# EAGLE design UI Adapter (EAGLE 9.6.0)

## Sheet 1 of 2
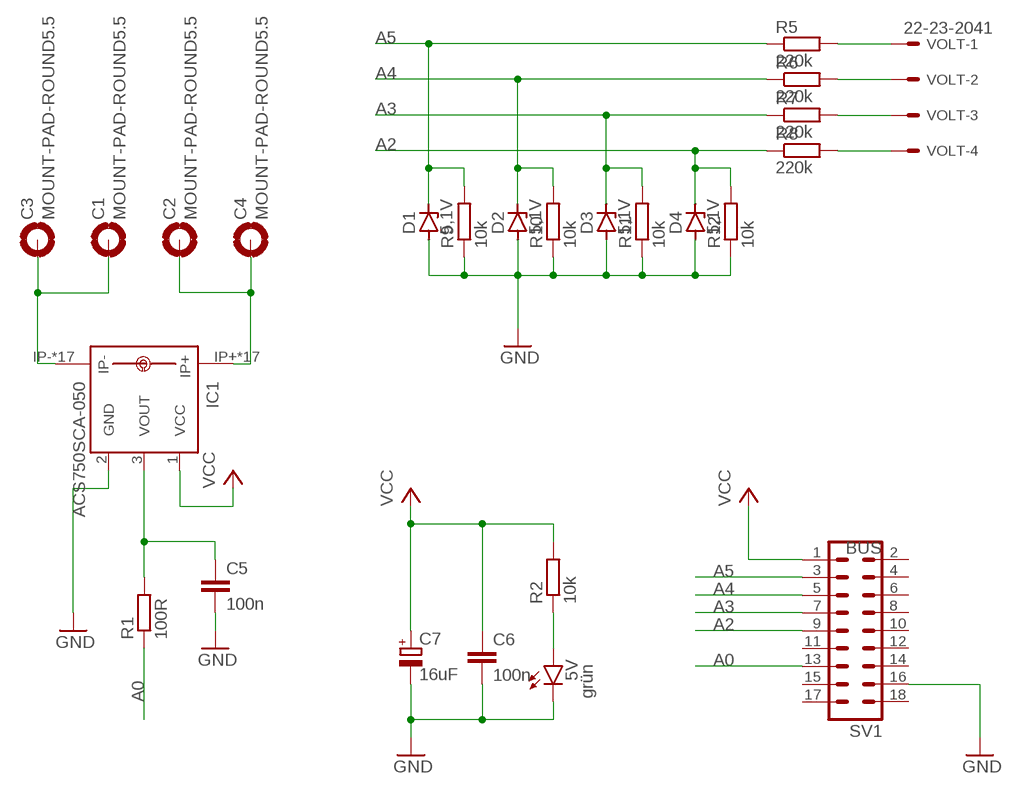
[diagram p0: schematic, sheet 1]

### Parts
5V  grün  LED3MM  [LED3MM]
C1  MOUNT-PAD-ROUND5.5  [5,5-PAD]
C2  MOUNT-PAD-ROUND5.5  [5,5-PAD]
C3  MOUNT-PAD-ROUND5.5  [5,5-PAD]
C4  MOUNT-PAD-ROUND5.5  [5,5-PAD]
C5  100n  C-EU025-024X044  [C025-024X044]
C6  100n  C-EU025-024X044  [C025-024X044]
C7  16uF  CPOL-EUE2-5  [E2-5]
D1  5,1V  ZENER-DIODEZD-7.5  [ZDIO-7.5]
D2  5,1V  ZENER-DIODEZD-7.5  [ZDIO-7.5]
D3  5,1V  ZENER-DIODEZD-7.5  [ZDIO-7.5]
D4  5,1V  ZENER-DIODEZD-7.5  [ZDIO-7.5]
IC1  ACS750SCA-050  [ACS75050]
R1  100R  R-EU_0204/2V  [0204V]
R2  10k  R-EU_0204/2V  [0204V]
R5  220k  R-EU_0204/2V  [0204V]
R6  220k  R-EU_0204/2V  [0204V]
R7  220k  R-EU_0204/2V  [0204V]
R8  220k  R-EU_0204/2V  [0204V]
R9  10k  R-EU_0204/2V  [0204V]
R10  10k  R-EU_0204/2V  [0204V]
R11  10k  R-EU_0204/2V  [0204V]
R12  10k  R-EU_0204/2V  [0204V]
SV1  BUS  MA09-2  [MA09-2]
VOLT  22-23-2041  [22-23-2041]

### Nets
A0: R1.1 SV1.13
A2: D4.C R8.1 R12.2 SV1.9
A3: D3.C R7.1 R11.2 SV1.7
A4: D2.C R6.1 R10.2 SV1.5
A5: D1.C R5.1 R9.2 SV1.3
C1: C1.B5,5(MOUNT) C3.B5,5(MOUNT) IC1.IP- IC1.IP-@2(IP-) IC1.IP-@3(IP-) IC1.IP-@4(IP-) IC1.IP-@5(IP-) IC1.IP-@6(IP-) IC1.IP-@7(IP-) IC1.IP-@8(IP-) IC1.IP-@9(IP-) IC1.IP-@10(IP-) IC1.IP-@11(IP-) IC1.IP-@12(IP-) IC1.IP-@13(IP-) IC1.IP-@14(IP-) IC1.IP-@15(IP-) IC1.IP-@16(IP-) IC1.IP-@17(IP-)
C2: C2.B5,5(MOUNT) C4.B5,5(MOUNT) IC1.IP+ IC1.IP+@2(IP+) IC1.IP+@3(IP+) IC1.IP+@4(IP+) IC1.IP+@5(IP+) IC1.IP+@6(IP+) IC1.IP+@7(IP+) IC1.IP+@8(IP+) IC1.IP+@9(IP+) IC1.IP+@10(IP+) IC1.IP+@11(IP+) IC1.IP+@12(IP+) IC1.IP+@13(IP+) IC1.IP+@14(IP+) IC1.IP+@15(IP+) IC1.IP+@16(IP+) IC1.IP+@17(IP+)
GND: 5V.K(C) C5.2 C6.2 C7.- D1.A D2.A D3.A D4.A IC1.2(GND) R9.1 R10.1 R11.1 R12.1 SV1.16
N$1: 5V.A R2.1
N$3: C5.1 IC1.3(VOUT) R1.2
N$8: R5.2 VOLT.1
N$9: R6.2 VOLT.2
N$10: R7.2 VOLT.3
N$11: R8.2 VOLT.4
VCC: C6.1 C7.+ IC1.1(VCC) R2.2 SV1.1
Unconnected: SV1.2 SV1.4 SV1.6 SV1.8 SV1.10 SV1.11 SV1.12 SV1.14 SV1.15 SV1.17 SV1.18

## Sheet 2 of 2

## Library data of the parts
5V = led:LED: LED OSRAM: - CHIPLED LG R971, LG N971, LY N971, LG Q971, LY Q971, LO R971, LY R971 LH N974, LH R974 LS Q976, LO Q976, LY Q976 LO Q996 - Hyper CHIPLED LW Q18S LB Q993, LB Q99A, LB R99A - SideLED LS A670, LO A670, LY A670, LG A670, LP A670 LB A673, LV A673, LT A673, LW A673 LH A674 LY A675 LS A676, LA A676, LO A676, LY A676, LW A676 LS A679, LY A679, LG A679 - Hyper Micro SIDELED® LS Y876, LA Y876, LO Y876, LY Y876 LT Y87S - SmartLED LW L88C, LW L88S LB L89C, LB L89S, LG L890 LS L89K, LO L89K, LY L89K LS L896, LA L896, LO L896, LY L896 - TOPLED LS T670, LO T670, LY T670, LG T670, LP T670 LSG T670, LSP T670, LSY T670, LOP T670, LYG T670 LG T671, LOG T671, LSG T671 LB T673, LV T673, LT T673, LW T673 LH T674 LS T676, LA T676, LO T676, LY T676, LB T676, LH T676, LSB T676, LW T676 LB T67C, LV T67C, LT T67C, LS T67K, LO T67K, LY T67K, LW E67C LS E67B, LA E67B, LO E67B, LY E67B, LB E67C, LV E67C, LT E67C LW T67C LS T679, LY T679, LG T679 LS T770, LO T770, LY T770, LG T770, LP T770 LB T773, LV T773, LT T773, LW T773 LH T774 LS E675, LA E675, LY E675, LS T675 LS T776, LA T776, LO T776, LY T776, LB T776 LHGB T686 LT T68C, LB T68C - Hyper Mini TOPLED® LB M676 - Mini TOPLED Santana® LG M470 LS M47K, LO M47K, LY M47K Source: http://www.osram.convergy.de LUXEON: - LUMILED® LXK2-PW12-R00, LXK2-PW12-S00, LXK2-PW14-U00, LXK2-PW14-V00 LXK2-PM12-R00, LXK2-PM12-S00, LXK2-PM14-U00 LXK2-PE12-Q00, LXK2-PE12-R00, LXK2-PE12-S00, LXK2-PE14-T00, LXK2-PE14-U00 LXK2-PB12-K00, LXK2-PB12-L00, LXK2-PB12-M00, LXK2-PB14-N00, LXK2-PB14-P00, LXK2-PB14-Q00 LXK2-PR12-L00, LXK2-PR12-M00, LXK2-PR14-Q00, LXK2-PR14-R00 LXK2-PD12-Q00, LXK2-PD12-R00, LXK2-PD12-S00 LXK2-PH12-R00, LXK2-PH12-S00 LXK2-PL12-P00, LXK2-PL12-Q00, LXK2-PL12-R00 Source: www.luxeon.com KINGBRIGHT: KA-3528ASYC Source: www.kingbright.com
C1-C4 = holes:MOUNT-PAD-ROUND: MOUNTING PAD, round
C5 C6 = rcl:C-EU: CAPACITOR, European symbol; SPICEPREFIX: C
C7 = rcl:CPOL-EU: POLARIZED CAPACITOR, European symbol; SPICEPREFIX: C
D1-D4 = diode:ZENER-DIODE: Z-Diode
IC1 = allegro:ACS750*CA-050: Current Sensor display layer 49 Reference in BRD and place VIAs on circles Source: www.allegromicro.com/datafile/0750-050.pdf; MF: ALLEGRO MICROSYSTEMS, INC.; MPN: ACS750SCA-050; OC_FARNELL: 1457175; OC_NEWARK: 81H6588
R1 R2 R5-R12 = rcl:R-EU_: RESISTOR, European symbol; SPICEPREFIX: R
SV1 = con-lstb:MA09-2: PIN HEADER; OC_FARNELL: unknown; OC_NEWARK: unknown
VOLT = con-molex:22-23-2041: .100" (2.54mm) Center Header - 4 Pin; MF: MOLEX; MPN: 22-23-2041; OC_FARNELL: 1462920; OC_NEWARK: 38C0355

## Board
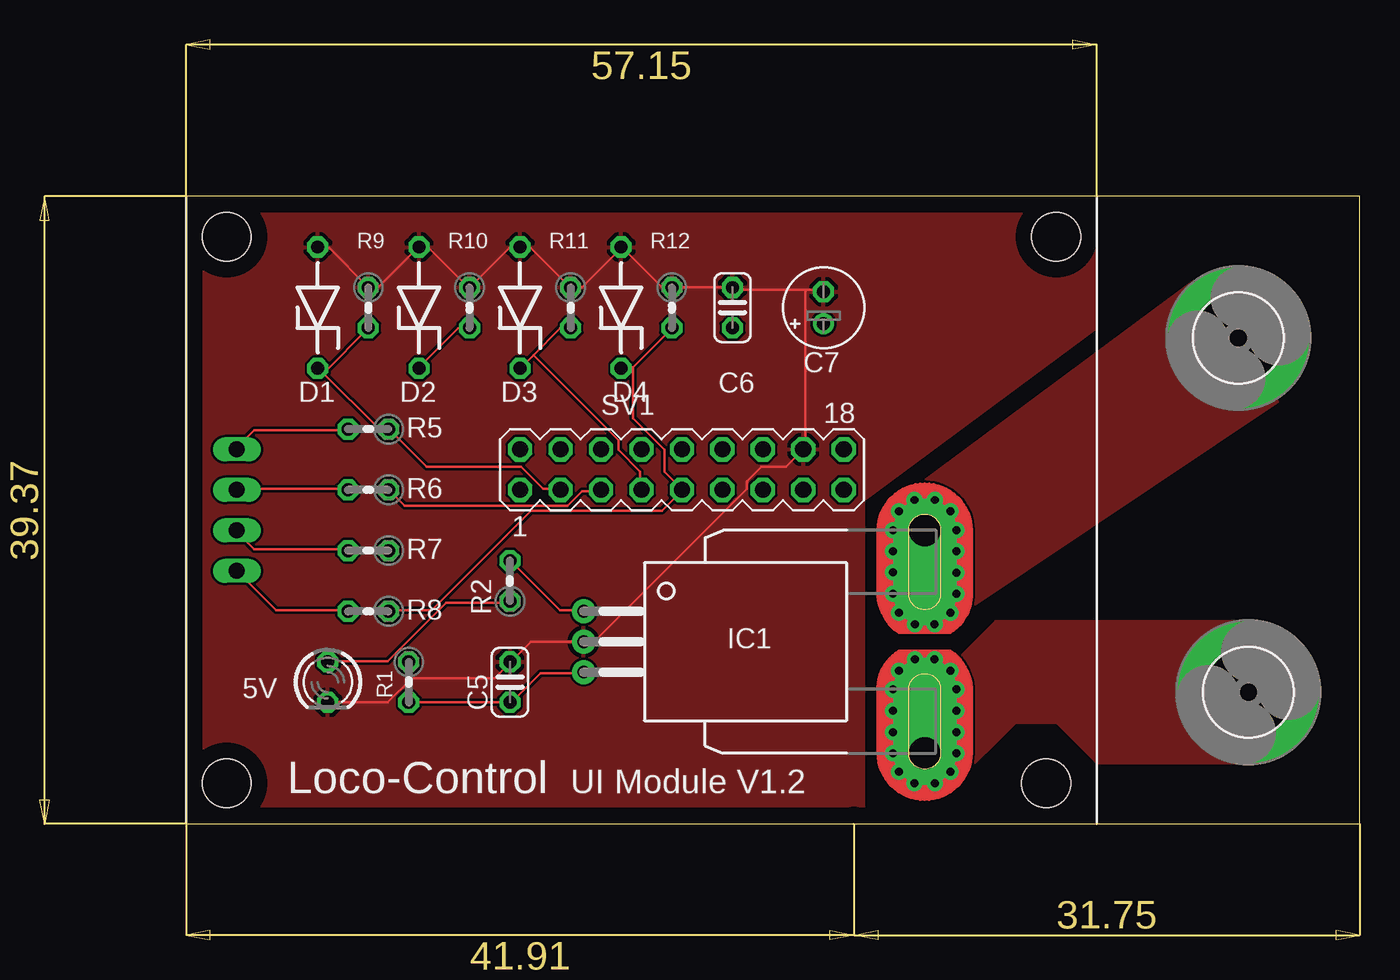
[diagram p1: board, top side]
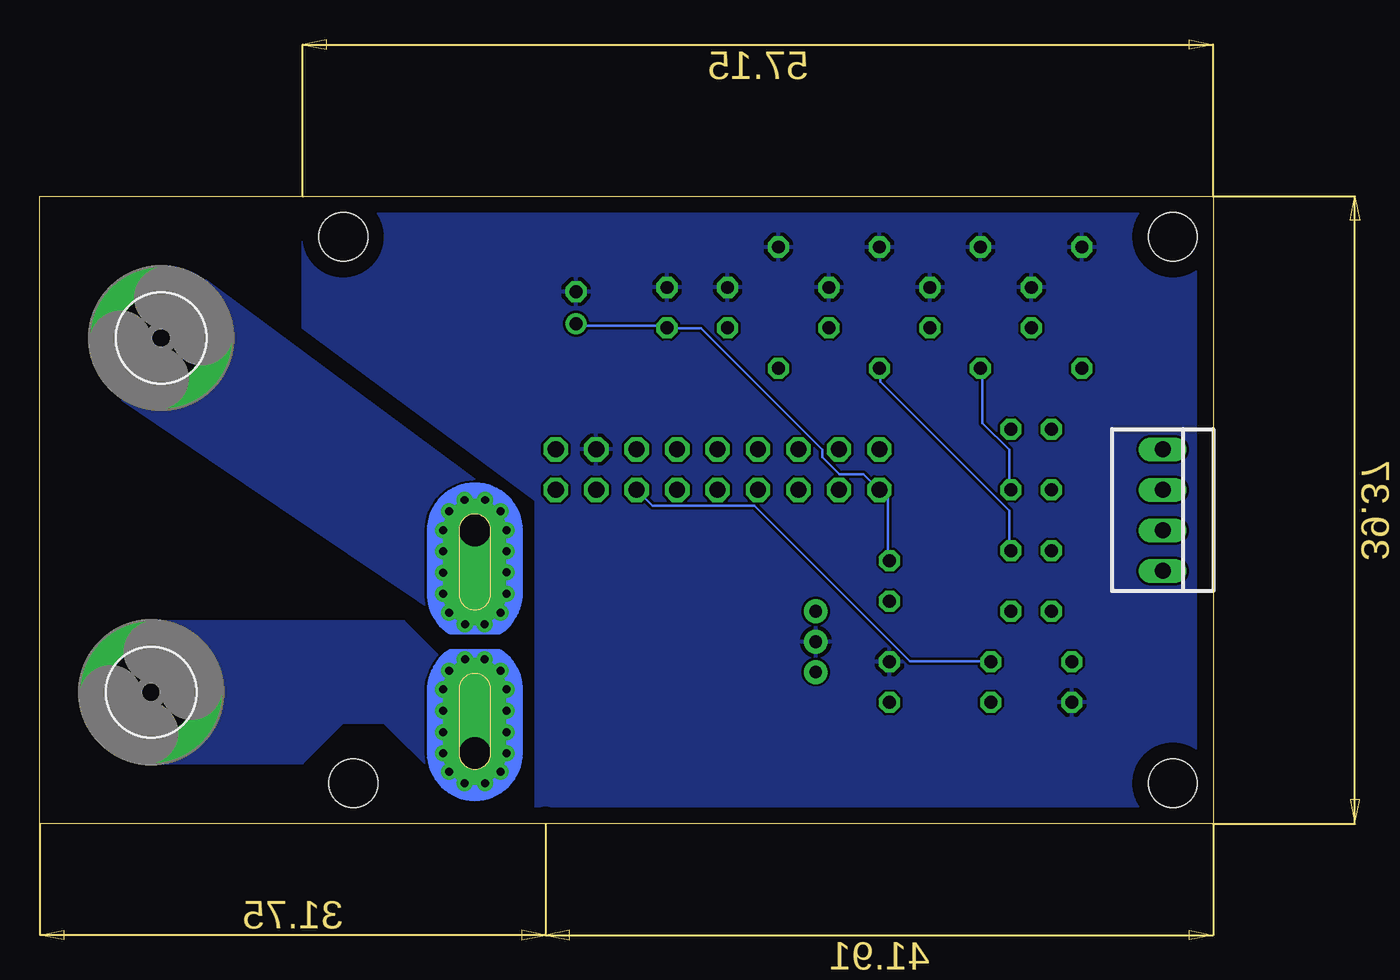
[diagram p2: board, bottom side, seen from below]

Size 73.66 x 39.37 mm. Coordinates in mm from the lower left corner, seen from the top.
Outline: 0,0 73.66,0 73.66,39.37 0,39.37 0,0
Copper layers (1*16): Top 0.035mm / dielectric 1.5mm / Bottom 0.035mm
Design rules "default": minimum track width 6mil, minimum drill 0.35mm, track to track 6mil, track to pad 6mil, pad to pad 6mil, via to via 6mil, smd to smd 6mil, copper to edge 40mil, drill to drill 6mil, minimum pad ring 10mil, minimum via ring 8mil, stop-mask expansion 4mil, vias tented up to drill 0mil, thermal gap 10mil
Holes 3.05 mm at 2.54,36.83 2.54,2.54 54.61,36.83 53.98,2.54

### Footprints (pad centres in the part's own frame; a part is rotated, then mirrored left to right if it is on the bottom)
LED3MM = drill 0.813 octagon: A -1.27,0; K 1.27,0
5,5-PAD = drill 5.5 pad 9: B5,5 0,0
C025-024X044 = drill 0.813 octagon: 1 -1.27,0; 2 1.27,0
E2-5 = drill 0.813 pad 1.27: + -1.016,0 | drill 0.813 pad 1.27 octagon: - 1.016,0
ZDIO-7.5 = drill 0.813 octagon: A 3.81,0; C -3.81,0
ACS75050 = drill 0.8 pad 1.5: 1 -1.91,-21.4; 2 0,-21.4; 3 1.91,-21.4 | drill 2 pad 4 offset: IP+ 7,0; IP- -7,0 | drill 0.5 pad 0.9: IP+@2 8.89,-0.635; IP+@3 8.89,0.635; IP+@4 8.175,1.625; IP+@5 7,2; IP+@6 5.675,2; IP+@7 4.325,2; IP+@8 3,2; IP+@9 1.825,1.625; IP+@10 1.1,0.625; IP+@11 1.1,-0.625; IP+@12 1.825,-1.625; IP+@13 3,-2; IP+@14 4.325,-2; IP+@15 5.675,-2; IP+@16 7,-2; IP+@17 8.175,-1.625; IP-@2 -8.89,-0.635; IP-@3 -8.89,0.635; IP-@4 -8.175,1.625; IP-@5 -7,2; IP-@6 -5.675,2; IP-@7 -4.325,2; IP-@8 -3,2; IP-@9 -1.825,1.625; IP-@10 -1.1,0.625; IP-@11 -1.1,-0.625; IP-@12 -1.825,-1.625; IP-@13 -3,-2; IP-@14 -4.35,-2; IP-@15 -5.675,-2; IP-@16 -7,-2; IP-@17 -8.175,-1.625
0204V = drill 0.813 octagon: 1 -1.27,0; 2 1.27,0
MA09-2 = drill 1.016 octagon: 1 -10.16,-1.27; 2 -10.16,1.27; 3 -7.62,-1.27; 4 -7.62,1.27; 5 -5.08,-1.27; 6 -5.08,1.27; 7 -2.54,-1.27; 8 -2.54,1.27; 9 0,-1.27; 10 0,1.27; 11 2.54,-1.27; 12 2.54,1.27; 13 5.08,-1.27; 14 5.08,1.27; 15 7.62,-1.27; 16 7.62,1.27; 17 10.16,-1.27; 18 10.16,1.27
22-23-2041 = drill 1 long: 1 -3.81,0; 2 -1.27,0; 3 1.27,0; 4 3.81,0

### Placement (x,y rotation side)
5V  8.89,8.89 270 top
C1  66.04,30.48 0 top
C2  66.67,8.26 0 top
C3  66.04,30.48 0 bottom
C4  66.67,8.26 0 bottom
C5  20.32,8.89 90 top
C6  34.29,32.38 90 top
C7  40.01,32.38 90 top
D1  8.26,32.38 90 top
D2  14.61,32.38 90 top
D3  20.95,32.38 90 top
D4  27.3,32.38 90 top
IC1  46.35,11.43 270 top
R1  13.97,8.89 270 top
R2  20.32,15.24 90 top
R5  11.43,24.77 180 top
R6  11.43,20.95 180 top
R7  11.43,17.14 180 top
R8  11.43,13.34 180 top
R9  11.43,32.38 270 top
R10  17.78,32.38 270 top
R11  24.13,32.38 270 top
R12  30.48,32.38 270 top
SV1  31.11,22.23 0 top
VOLT  3.17,19.68 270 bottom

### Tracks (layer width: path | path; a pad name or v marks a point on that pad's centre or on a via)
A0
  Bottom 0.152: SV1.13 35.2,19.96 28.8,19.96 19.05,10.21 14.02,10.21 R1.1
A2
  Top 0.152: 28.04,28.65 27.43,28.65 D4.C | 28.04,28.65 30.48,31.09 R12.2 | R8.1 12.8,13.41 15.39,13.41 21.64,19.66 29.87,19.66 31.09,20.88 SV1.9 31.09,21.03 30.02,22.1 30.02,23.47 28.04,25.45 28.04,28.65
A3
  Top 0.152: D3.C 21.79,29.41 | 21.79,29.41 23.47,31.09 24.08,31.09 R11.2 | 21.79,29.41 27.13,24.08 27.13,23.47 28.5,22.1 28.5,21.03 SV1.7
  Bottom 0.152: R7.1 12.8,17.22 12.8,19.66 20.88,27.74 20.88,28.5 D3.C
A4
  Top 0.152: R10.2 17.68,31.09 17.07,31.09 14.63,28.65 D2.C | SV1.5 25.91,20.88 24.84,20.88 23.93,19.96 13.72,19.96 12.8,20.88 R6.1
  Bottom 0.152: R6.1 12.8,21.03 12.8,23.47 14.48,25.15 14.48,28.5 D2.C
A5
  Top 0.152: 8.53,28.35 8.38,28.5 D1.C 8.53,28.35 | 8.53,28.35 12.04,24.84 12.65,24.84 R5.1 12.8,24.69 15.09,22.4 21.03,22.4 22.4,21.03 23.47,21.03 SV1.3 | 8.53,28.35 8.69,28.35 11.43,31.09 R9.2
C1
  pour Top (no thermals): 43.81,19.68 63.22,34.06 68.51,26.49 48.9,13.34 43.81,15.88
  pour Bottom (no thermals): 43.81,19.71 63.21,34.07 68.46,26.57 48.9,13.34 43.81,15.88
C2
  pour Top (no thermals): 66.67,12.7 50.8,12.7 48.26,10.16 46.35,10.16 46.35,2.54 48.26,2.54 52.07,6.35 54.61,6.35 57.15,3.81 66.67,3.81
  pour Bottom (no thermals): 66.67,12.7 50.8,12.7 46.35,8.26 46.35,3.17 48.9,3.17 52.07,6.35 54.61,6.35 57.15,3.81 66.67,3.81
GND
  Top 0.152: 5V.K 12.65,7.62 14.17,9.14 19.36,9.14 20.27,10.06 C5.2 20.42,10.21 21.64,11.43 IC1.2 25.6,11.43 35.2,21.03 35.2,21.49 36.12,22.4 37.64,22.4 SV1.16 38.86,23.62 38.86,33.53 | 30.48,33.68 34.29,33.68 C6.2 34.29,33.53 38.86,33.53 | 38.86,33.53 39.93,33.53 C7.- | 11.43,33.68 8.99,36.12 8.38,36.12 D1.A | 11.43,33.68 12.04,33.68 14.48,36.12 D2.A 14.63,36.12 15.24,36.12 17.68,33.68 R10.1 17.83,33.68 20.27,36.12 20.88,36.12 D3.A 21.03,36.12 21.64,36.12 24.08,33.68 R11.1 24.23,33.68 24.84,33.68 27.28,36.12 D4.A 27.43,36.12 29.87,33.68 30.48,33.68 | 11.43,33.68 R9.1 | 30.48,33.68 R12.1
  pour Top: 0,39.37 57.15,39.37 57.15,31.11 42.55,20.32 42.55,0 0,0
  pour Bottom: 0,39.37 57.15,39.37 57.15,31.11 42.55,20.32 42.55,0 0,0
N$1
  Top 0.152: 5V.A 8.99,10.21 12.65,10.21 16.31,13.87 20.27,13.87 R2.1
N$3
  Top 0.152: R1.2 C5.1 20.42,7.62 22.25,9.45 24.84,9.45 IC1.3
N$8
  Top 0.152: R5.2 10.06,24.69 4.27,24.69 3.2,23.62 VOLT.1
N$9
  Top 0.152: R6.2 10.06,21.03 3.2,21.03 VOLT.2
N$10
  Top 0.152: R7.2 10.06,17.22 4.27,17.22 3.2,18.29 VOLT.3
N$11
  Top 0.152: VOLT.4 5.64,13.41 10.06,13.41 R8.2
VCC
  Top 0.152: IC1.1 24.84,13.41 23.47,13.41 20.42,16.46 R2.2
  Bottom 0.152: C7.+ 39.93,31.24 34.29,31.24 C6.1 34.29,31.09 32.16,31.09 24.54,23.47 24.54,23.01 23.47,21.95 21.95,21.95 SV1.1 20.42,20.42 20.42,16.61 R2.2

### Text on the board
tNames: Loco-Control | UI Module V1.2